# Altium schematic sheet drivers.SchDoc
size A3
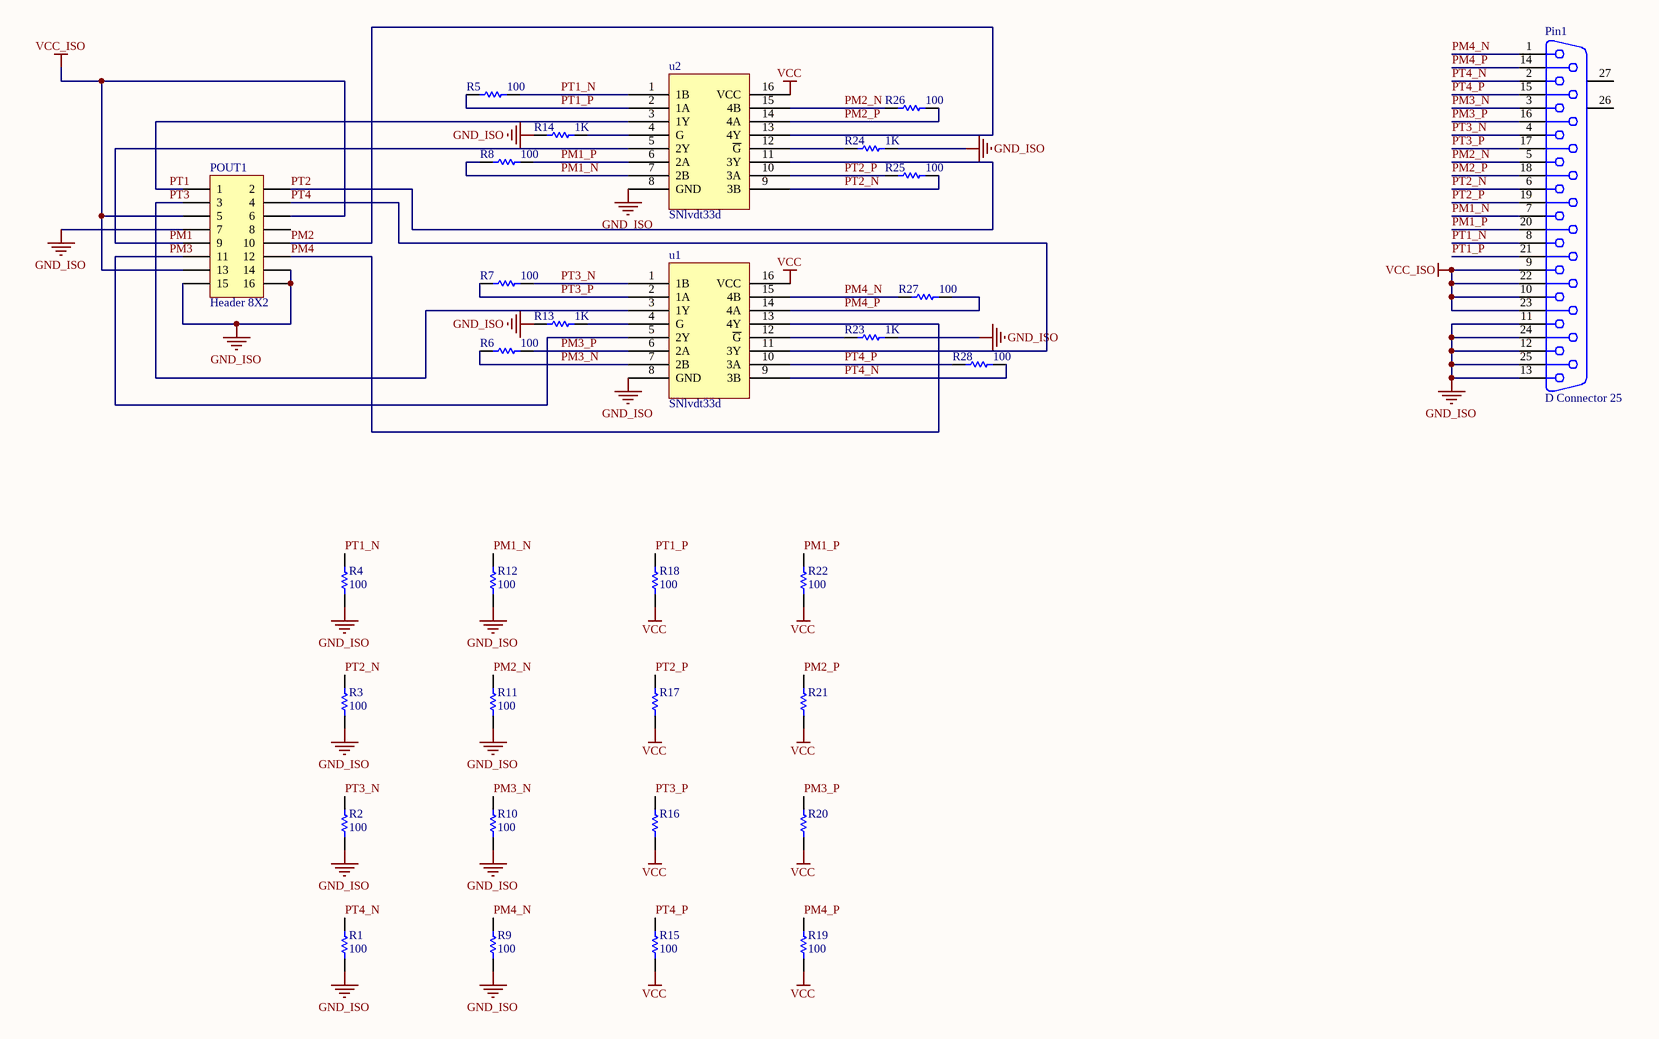
[diagram p0: drivers.SchDoc]

## Parts
Pin1  D Connector 25  [DSUB1.385-2H25A]
POUT1  Header 8X2  [HDR2X8]
R1  value 100  [2012[0805]]  (hidden comment: Res Semi)
R2  value 100  [2012[0805]]  (hidden comment: Res Semi)
R3  value 100  [2012[0805]]  (hidden comment: Res Semi)
R4  value 100  [2012[0805]]  (hidden comment: Res Semi)
R5  value 100  [2012[0805]]  (hidden comment: Res Semi)
R6  value 100  [2012[0805]]  (hidden comment: Res Semi)
R7  value 100  [2012[0805]]  (hidden comment: Res Semi)
R8  value 100  [2012[0805]]  (hidden comment: Res Semi)
R9  value 100  [2012[0805]]  (hidden comment: Res Semi)
R10  value 100  [2012[0805]]  (hidden comment: Res Semi)
R11  value 100  [2012[0805]]  (hidden comment: Res Semi)
R12  value 100  [2012[0805]]  (hidden comment: Res Semi)
R13  value 1K  [2012[0805]]  (hidden comment: Res Semi)
R14  value 1K  [2012[0805]]  (hidden comment: Res Semi)
R15  value 100  [2012[0805]]  (hidden comment: Res Semi)
R16  Res Semi  [2012[0805]]  (value not drawn)
R17  Res Semi  [2012[0805]]  (value not drawn)
R18  value 100  [2012[0805]]  (hidden comment: Res Semi)
R19  value 100  [2012[0805]]  (hidden comment: Res Semi)
R20  Res Semi  [2012[0805]]  (value not drawn)
R21  Res Semi  [2012[0805]]  (value not drawn)
R22  value 100  [2012[0805]]  (hidden comment: Res Semi)
R23  value 1K  [2012[0805]]  (hidden comment: Res Semi)
R24  value 1K  [2012[0805]]  (hidden comment: Res Semi)
R25  value 100  [2012[0805]]  (hidden comment: Res Semi)
R26  value 100  [2012[0805]]  (hidden comment: Res Semi)
R27  value 100  [2012[0805]]  (hidden comment: Res Semi)
R28  value 100  [2012[0805]]  (hidden comment: Res Semi)
u1  SNlvdt33d  [R-16]
u2  SNlvdt33d  [R-16]

## Nets
GND_ISO: Pin1.11 Pin1.12 Pin1.13 Pin1.24 Pin1.25 POUT1.7 POUT1.14 POUT1.15 POUT1.16 R1.2 R2.2 R3.2 R4.2 R9.2 R10.2 R11.2 R12.2 R13.1 R14.1 R23.2 R24.2 u1.8(GND) u2.8(GND)
VCC: R15.2 R16.2 R17.2 R18.2 R19.2 R20.2 R21.2 R22.2 u1.16(VCC) u2.16(VCC)
VCC_ISO: Pin1.9 Pin1.10 Pin1.22 Pin1.23 POUT1.5 POUT1.6 POUT1.13
PM1: POUT1.9 u2.5(2Y)
PM1_N: Pin1.7 R8.1 R12.1 u2.7(2B)
PM1_P: Pin1.20 R8.2 R22.1 u2.6(2A)
PM2: POUT1.10 u2.13(4Y)
PM2_N: Pin1.5 R11.1 R26.1 u2.15(4B)
PM2_P: Pin1.18 R21.1 R26.2 u2.14(4A)
PM3: POUT1.11 u1.5(2Y)
PM3_N: Pin1.3 R6.1 R10.1 u1.7(2B)
PM3_P: Pin1.16 R6.2 R20.1 u1.6(2A)
PM4: POUT1.12 u1.13(4Y)
PM4_N: Pin1.1 R9.1 R27.1 u1.15(4B)
PM4_P: Pin1.14 R19.1 R27.2 u1.14(4A)
PT1: POUT1.1 u2.3(1Y)
PT1_N: Pin1.8 R4.1 R5.2 u2.1(1B)
PT1_P: Pin1.21 R5.1 R18.1 u2.2(1A)
PT2: POUT1.2 u2.11(3Y)
PT2_N: Pin1.6 R3.1 R25.2 u2.9(3B)
PT2_P: Pin1.19 R17.1 R25.1 u2.10(3A)
PT3: POUT1.3 u1.3(1Y)
PT3_N: Pin1.4 R2.1 R7.2 u1.1(1B)
PT3_P: Pin1.17 R7.1 R16.1 u1.2(1A)
PT4: POUT1.4 u1.11(3Y)
PT4_N: Pin1.2 R1.1 R28.2 u1.9(3B)
PT4_P: Pin1.15 R15.1 R28.1 u1.10(3A)
NetR13_2: R13.2 u1.4(G)
NetR14_2: R14.2 u2.4(G)
NetR23_1: R23.1 u1.12(~{G})
NetR24_1: R24.1 u2.12(~{G})

Not connected (* = marked no-connect by the designer): Pin1 26(MH1) 27(MH2); POUT1 8

## Library data of the parts
Pin1 = D Connector 25: Receptacle Assembly, 25 Position, Right Angle; PackageDocument: U; Positions: 25; Published: 15-Jun-2001; LatestRevisionDate: 17-Jul-2002; LatestRevisionNote: Re-released for DXP Platform.; DatasheetDocument: 19-Mar-1999; PackageReference: 787202; Publisher: Altium Limited; Orientation: Right Angle; Gender: Receptacle
POUT1 = Header 8X2: Header, 8-Pin, Dual row; LatestRevisionDate: 17-Jul-2002; LatestRevisionNote: Re-released for DXP Platform.; Publisher: Altium Limited
R1-R28 = Res Semi: Semiconductor Resistor; Published: 8-Jun-2000; LatestRevisionDate: 17-Jul-2002; LatestRevisionNote: Re-released for DXP Platform.; PackageReference: AXIAL-0.5; Publisher: Altium Limited